# EAGLE design FAN (EAGLE 7.4.0)
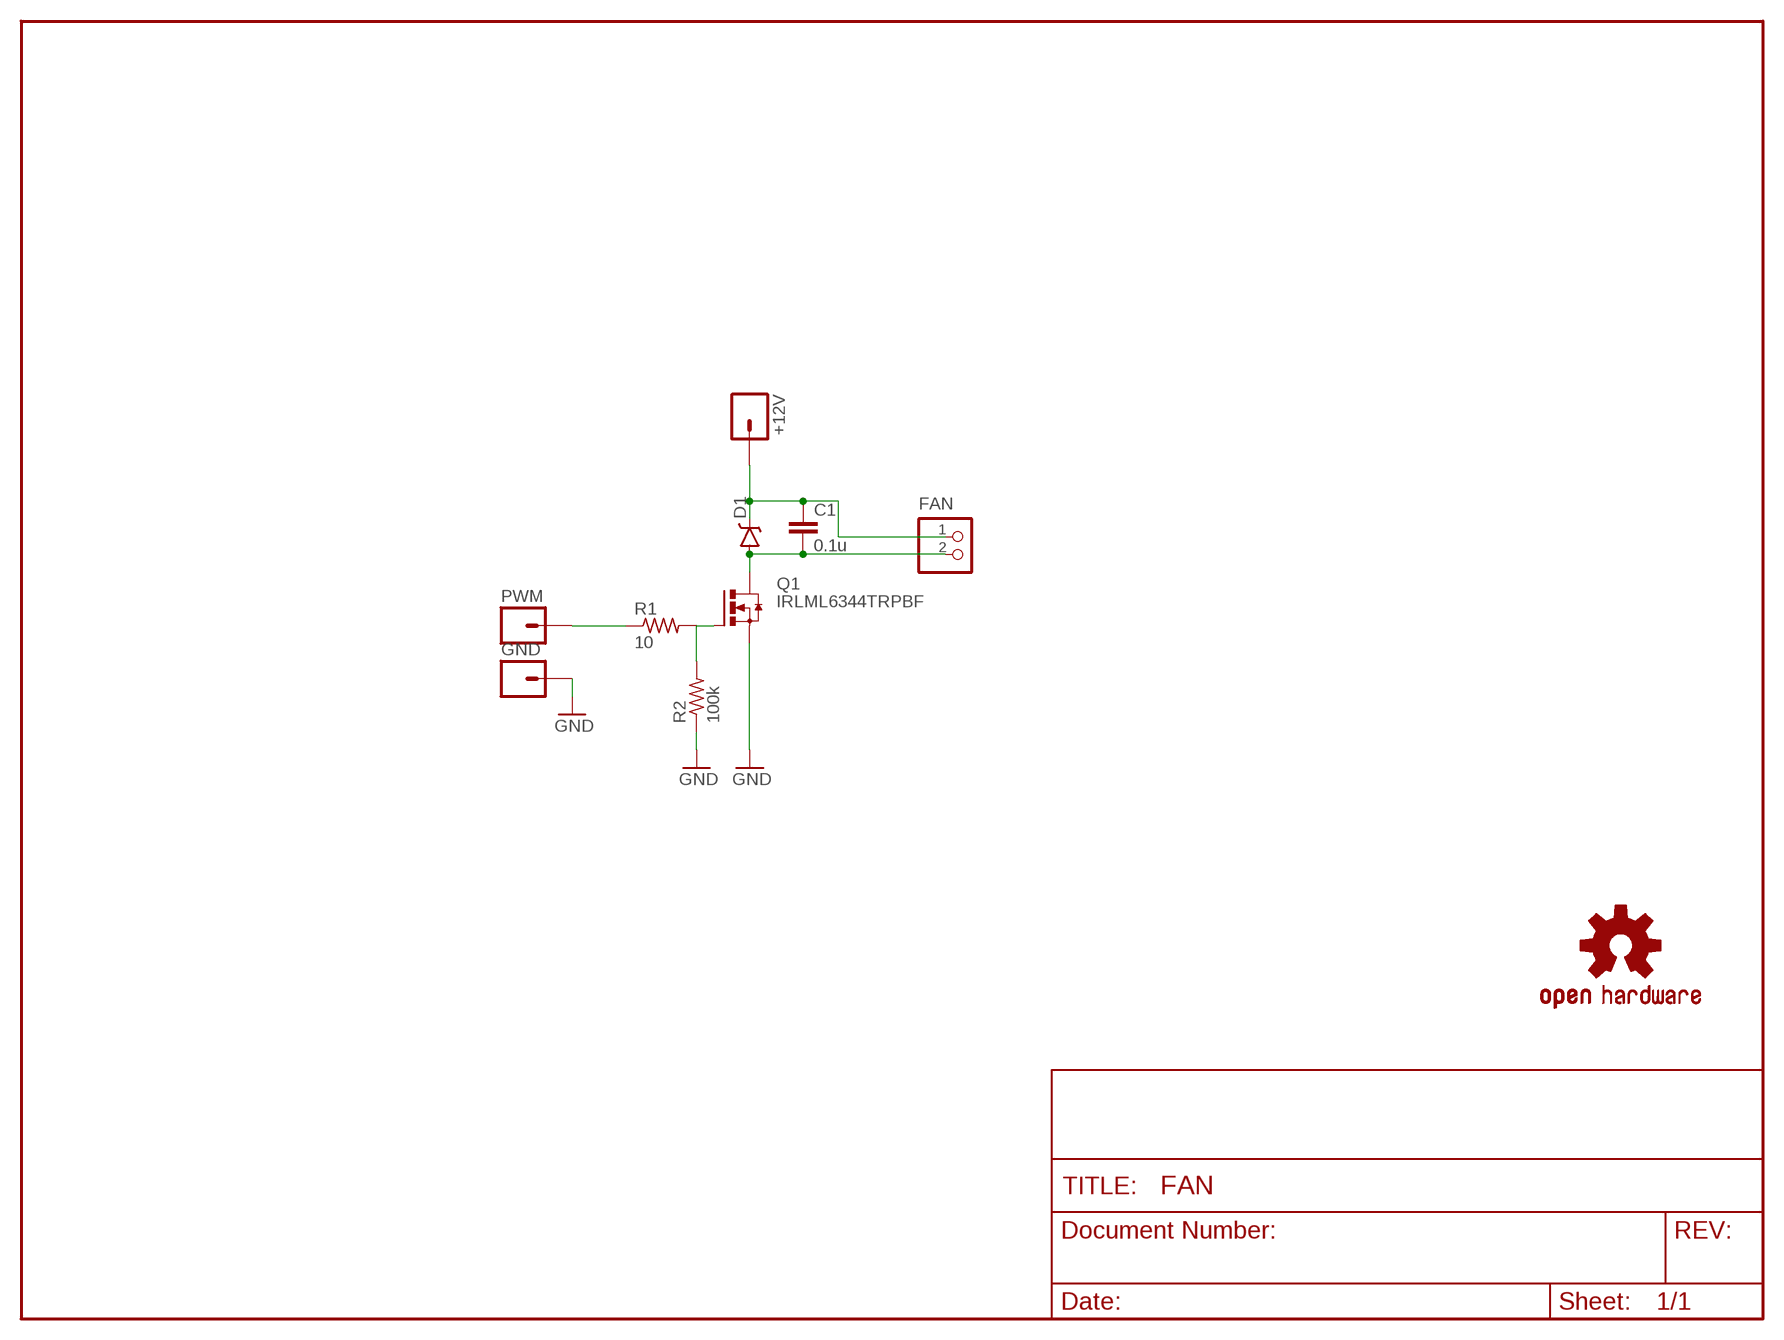
[diagram p0: schematic, sheet 1]

## Parts
+12V  M01PTH  [1X01]
C1  0.1u  CAP0603-CAP  [0603-CAP]
D1  DIODE-SCHOTTKY  [TUMD2]
FAN  S2B-XH-A  [S2B-XH-A]
GND  M01PTH  [1X01]
PWM  M01PTH  [1X01]
Q1  IRLML6344TRPBF  [SOT-23-3]
R1  10  R-US_1608  [1608]
R2  100k  R-US_1608  [1608]
U$1  OSHW-LOGOS  [OSHW-LOGO-S]

## Nets
+12V: +12V.1 C1.1 D1.C FAN.1
FAN: C1.2 D1.A FAN.2 Q1.3(D)
GND: GND.1 Q1.2(S) R2.P$1
N$1: PWM.1 R1.P$1
N$2: Q1.1(G) R1.P$2 R2.P$2

## Library data of the parts
+12V GND PWM = SparkFun-Connectors:M01: Header 1 Standard 1-pin 0.1" header. Use with straight break away headers (SKU : PRT-00116), right angle break away headers (PRT-00553), swiss pins (PRT-00743), machine pins (PRT-00117), and female headers (PRT-00115).
C1 = SparkFun:CAP: Capacitor Standard 0603 ceramic capacitor, and 0.1" leaded capacitor.
D1 = KinyaLibrary:DIODE-SCHOTTKY: Schottky diodes in SFE's production catalog BAT20J 1A 23V 0.62Vf RB751 120mA 40V 0.37Vf PMEG4005EJ 0.5A 40V 0.42Vf MBRA140 1A 40V 0.5Vf B340A 3A 40V SMA
FAN = jst-xh:S2B-XH-A: Wire-to-Board 2.5mm pitch side mount connector Source: http://www.jst-mfg.com/product/pdf/jpn/XH.pdf http://www.jst-mfg.com/product/detail.php?series=277
Q1 = KinyaLibrary:IRLML*: N-Channel MOSFET HEXFET® Documentation Datasheet <http://www.irf.com/product-info/datasheets/data/irlml6344pbf.pdf>; CATEGORY: Discrete Semiconductor Products; CURRENT-CONTINUOUS_DRAIN: 5A (Ta); DESCRIPTION: MOSFET N-CH 30V 5A SOT23; DOCUMENTATION_LINK: <a href="http://www.irf.com/product-info/datasheets/data/irlml6344pbf.pdf">Datasheet</a>; DOCUMENTATION_URL: http://www.irf.com/product-info/datasheets/data/irlml6344pbf.pdf; DRAIN_TO_SOURCE_VOLTAGE: 30V; FAMILY: FETs - Single; FET_FEATURE: Logic Level Gate; FET_TYPE: MOSFET N-Channel, Metal Oxide; GATE_CHARGE: 6.8nC @ 4.5V; INPUT_CAPACITANCE: 650pF @ 25V; MANUFACTURER: International Rectifier; MOUNTING_TYPE: Surface Mount; PACKAGE: TO-236-3, SC-59, SOT-23-3; PART_NUMBER: IRLML6344TRPBF; POWER-MAX: 1.3W; RDS_ON: 29 mOhm @ 5A, 4.5V; SERIES: HEXFET; SUPPLIER_DEVICE_PACKAGE: SOT-23; SUPPLIER_ITEM_LINK: <a href="http://www.digikey.com/product-detail/en/IRLML6344TRPBF/IRLML6344TRPBFCT-ND/2538168">Details</a>; SUPPLIER_ITEM_NUMBER: IRLML6344TRPBFCT-ND; SUPPLIER_ITEM_URL: http://www.digikey.com/product-detail/en/IRLML6344TRPBF/IRLML6344TRPBFCT-ND/2538168; SUPPLIER_LINK: <a href="http://www.digikey.com">Home Page</a>; SUPPLIER_NAME: Digi-Key; SUPPLIER_URL: http://www.digikey.com; VGS: 1.1V @ 10uA
R1 R2 = KinyaLibrary:R-US_: RESISTOR, American symbol
U$1 = SparkFun:OSHW-LOGO: Open Source Hardware Logo This logo indicates the piece of hardware it is found on incorporates a OSHW license and/or adheres to the definition of open source hardware found here: http://freedomdefined.org/OSHW

## Board
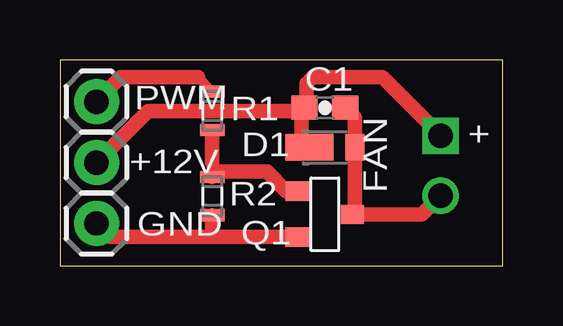
[diagram p1: board, top side]
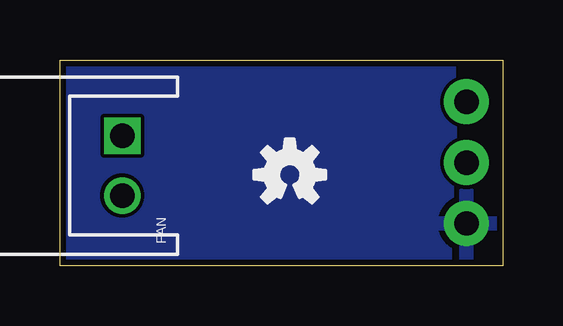
[diagram p2: board, bottom side, seen from below]

Size 18.48 x 8.6 mm. Coordinates in mm from the lower left corner, seen from the top.
Outline: 0,0 18.48,0 18.48,8.6 0,8.6 0,0
Copper layers (1*16): Top 0.035mm / dielectric 1.5mm / Bottom 0.035mm
Design rules "Elecrow_2-layer_eagle_rule": minimum track width 6mil, minimum drill 12mil, track to track 6mil, track to pad 6mil, pad to pad 6mil, via to via 6mil, smd to smd 0mil, copper to edge 10mil, drill to drill 10mil, minimum pad ring 10mil, minimum via ring 6mil, stop-mask expansion 2mil, vias tented up to drill 100mil, thermal gap 10mil

### Footprints (pad centres in the part's own frame; a part is rotated, then mirrored left to right if it is on the bottom)
1X01 = drill 1.016 pad 1.88: 1 0,0
0603-CAP = smd 1.1 x 1: 1 -0.85,0; 2 0.85,0
TUMD2 = smd 0.8 x 1.1: A 1.25,0 | smd 2 x 1.1: C -0.65,0
S2B-XH-A = drill 1.016 square: 1 1.25,0 | drill 1.016: 2 -1.25,0
SOT-23-3 = smd 0.802 x 0.972: 1 -0.96,-1.15; 2 0.95,-1.15; 3 0,1.15
1608 = smd 0.508 x 1.016: P$1 -0.8,0; P$2 0.8,0

### Placement (x,y rotation side)
+12V  1.52,4.32 0 top
C1  11.05,6.6 0 top
D1  11.05,4.95 0 top
FAN  15.88,4.19 90 bottom
GND  1.52,1.78 0 top
PWM  1.52,6.86 0 top
Q1  11.05,2.16 270 top
R1  6.35,6.48 270 top
R2  6.35,2.92 90 top
U$1  8.89,3.81 0 bottom

### Tracks (layer width: path | path; a pad name or v marks a point on that pad's centre or on a via)
+12V
  Top 0.61: +12V.1 3.68,6.48 10.07,6.48 | 10.07,6.48 C1.1 10.29,6.69 10.29,7.62 10.54,7.87 13.44,7.87 FAN.1 | 10.07,6.48 10.07,5.28 D1.C
FAN
  Top 0.61: C1.2 12.3,6.2 D1.A 12.3,2.26 Q1.3 15.09,2.16 FAN.2
GND
  Top 0.61: Q1.2 6.48,1.21 | 6.48,1.21 2.09,1.21 GND.1 | R2.P$1 6.35,1.34 6.48,1.21
  pour Bottom: -0.64,-0.51 -0.64,9.14 19.05,9.14 19.05,-0.51
N$1
  Top 0.406: 5.75,7.87 R1.P$1
  Top 0.61: PWM.1 2.54,7.87 5.75,7.87
N$2
  Top 0.406: R1.P$2 6.35,5.46 | 6.35,4.32 R2.P$2
  Top 0.61: 6.35,5.46 6.35,4.32 | Q1.1 9.45,3.12 8.64,3.94 6.57,3.94 R2.P$2

### Text on the board
tPlace: + | FAN